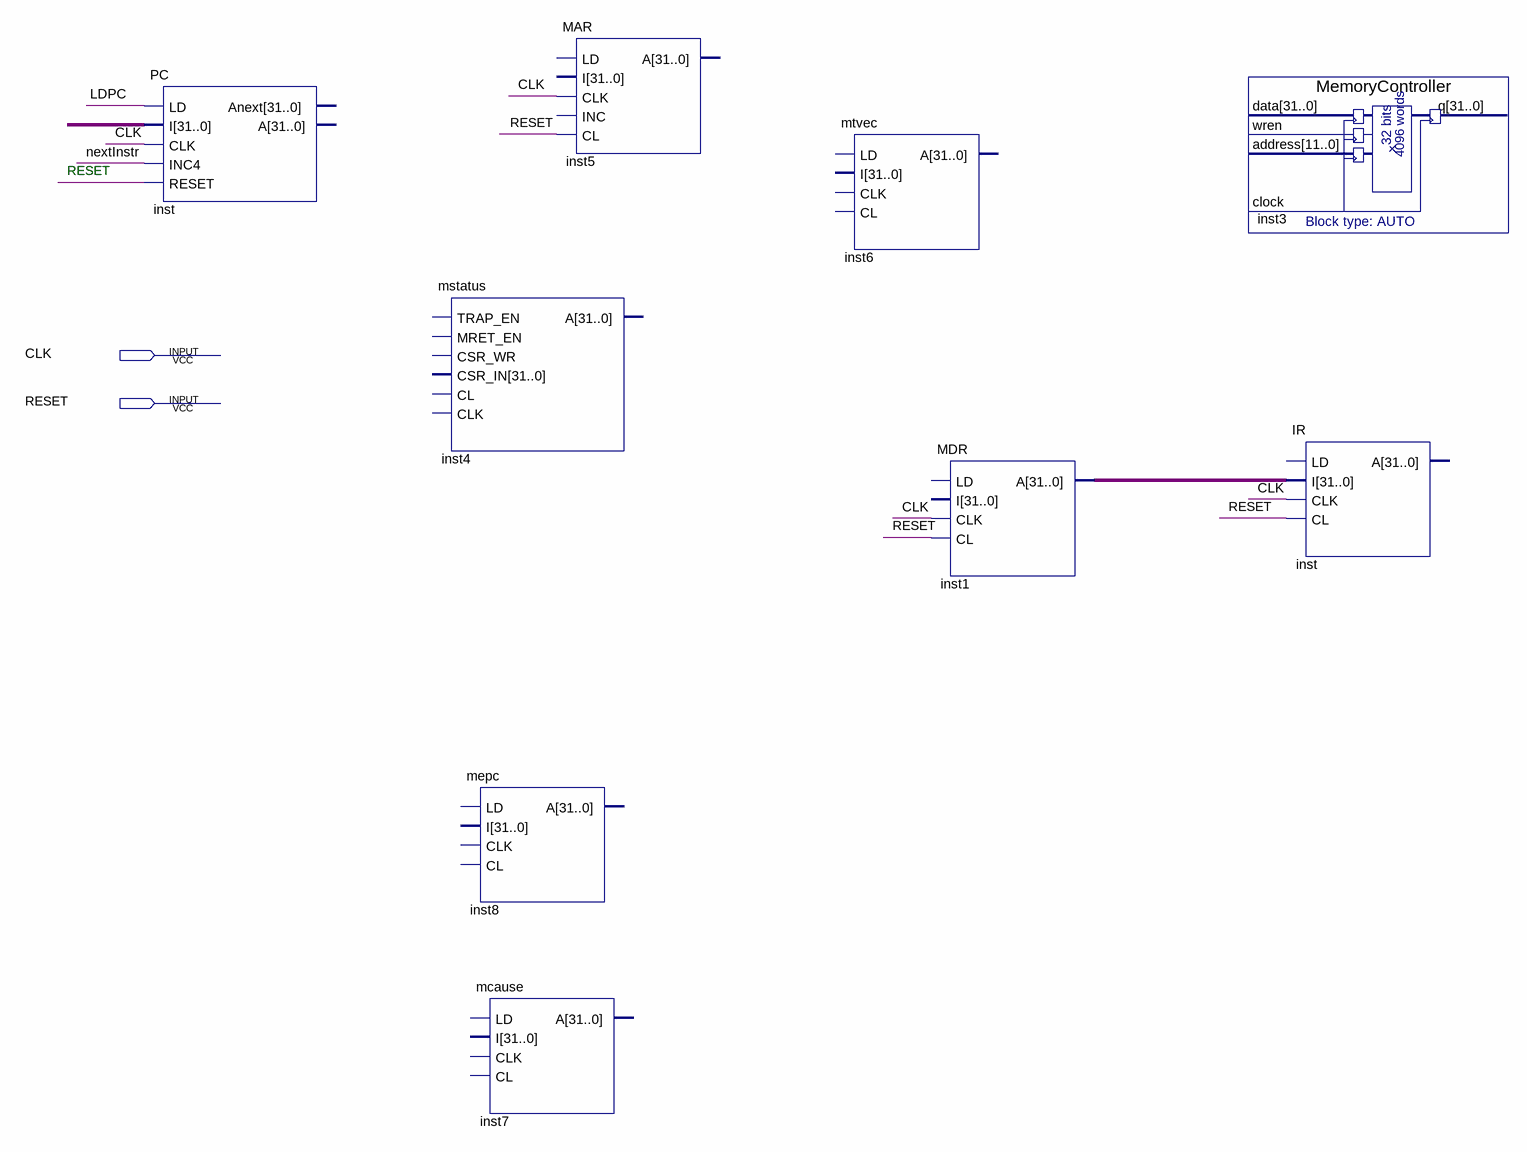
[diagram p0: schematic sheet]
// Quartus schematic OperationalUnit.bdf as structural Verilog: 9 symbols, 2 pins
module OperationalUnit (
  input  CLK,
  input  RESET
);

  wire LDPC, nextInstr;
  wire [31:0] inst1_a, undriven;

  PC inst (.LD(LDPC), .I(undriven), .CLK(CLK), .INC4(nextInstr), .RESET(RESET));  // open: Anext, A
  mstatus inst4 ();  // open: TRAP_EN, MRET_EN, CSR_WR, CSR_IN, CL, CLK, A
  mepc inst8 ();  // open: LD, I, CLK, CL, A
  mcause inst7 ();  // open: LD, I, CLK, CL, A
  MAR inst5 (.CLK(CLK), .CL(RESET));  // open: LD, I, INC, A
  mtvec inst6 ();  // open: LD, I, CLK, CL, A
  MDR inst1 (.CLK(CLK), .CL(RESET), .A(inst1_a));  // open: LD, I
  MemoryController inst3 ();  // open: data, wren, address, clock, q
  IR inst_dup2 (.I(inst1_a), .CLK(CLK), .CL(RESET));  // open: LD, A

  // Notes on the sheet:
  //   RESET
endmodule
